# Altium project BLDC_Motor_Driver_PCB.PrjPcb
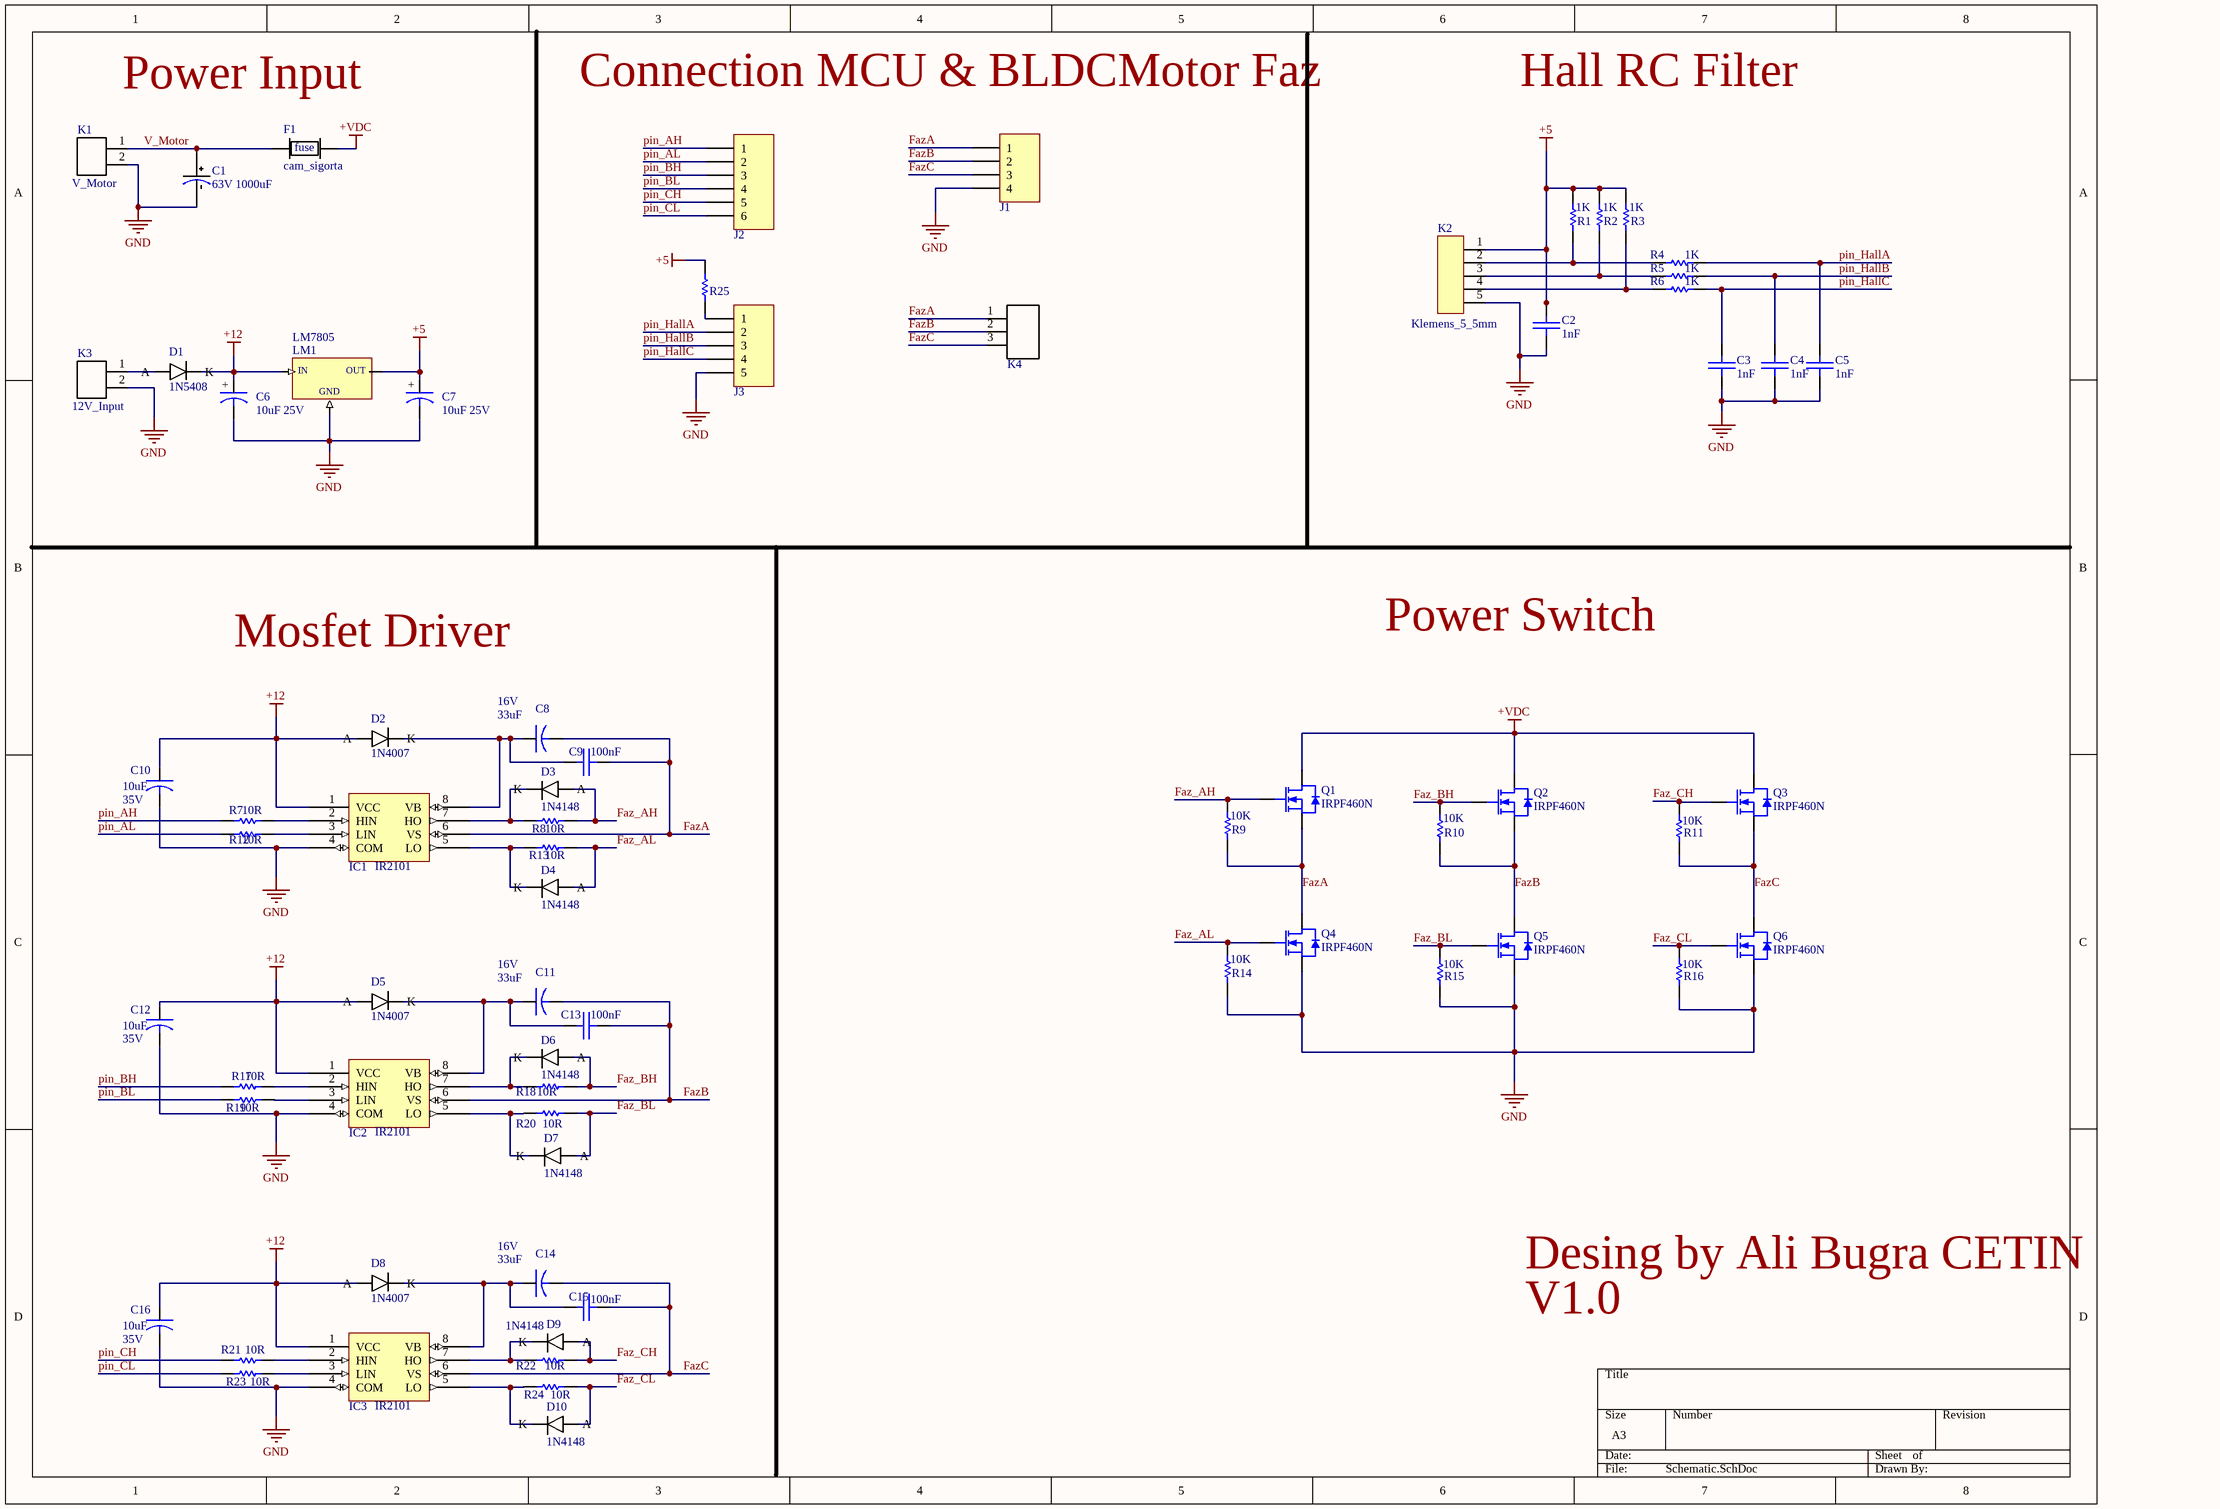
[diagram p0: Schematic.SchDoc]
1 sheet, 69 parts. Net scope: global (net labels, ports and power ports of the same name join across sheets).
Board file: DriverPCB.PcbDoc

## Sheet Schematic.SchDoc
size A3

### Parts
C1  63V 1000uF  [1000uF 10V]
C2  1nF  [100nF]
C3  1nF  [100nF]
C4  1nF  [100nF]
C5  1nF  [100nF]
C6  10uF 25V  [10uF 35V]
C7  10uF 25V  [10uF 35V]
C8  value 33uF  Voltage: 16V  [100uF 25v]  (hidden comment: 100uF 25v)
C9  100nF  [100nF]
C10  value 10uF  Voltage: 35V  [100uF 25v]  (hidden comment: 100uF 25v)
C11  value 33uF  Voltage: 16V  [100uF 25v]  (hidden comment: 100uF 25v)
C12  value 10uF  Voltage: 35V  [100uF 25v]  (hidden comment: 100uF 25v)
C13  100nF  [100nF]
C14  value 33uF  Voltage: 16V  [100uF 25v]  (hidden comment: 100uF 25v)
C15  100nF  [100nF]
C16  value 10uF  Voltage: 35V  [100uF 25v]  (hidden comment: 100uF 25v)
D1  1N5408  [1N5408]
D2  1N4007  [1N4007]
D3  1N4148  [1N4148]
D4  1N4148  [1N4148]
D5  1N4007  [1N4007]
D6  1N4148  [1N4148]
D7  1N4148  [1N4148]
D8  1N4007  [1N4007]
D9  1N4148  [1N4148]
D10  1N4148  [1N4148]
F1  cam_sigorta  [cam_sigorta]
IC1  IR2101  [IR2101-DIP]
IC2  IR2101  [IR2101-DIP]
IC3  IR2101  [IR2101-DIP]
J1  Header 4x1  [Header 4x1]  (value not drawn)
J2  Header 6x1  [Header 6x1]  (value not drawn)
J3  Header 5x1  [Header 5x1]  (value not drawn)
K1  V_Motor  [Klamens_2_3.5mm]
K2  Klemens_5_5mm  [Klamens_5_5mm]
K3  12V_Input  [Klamens_2_3.5mm]
K4  Klemens_3_7.6mm  [Klamens_3_7.6mm]  (value not drawn)
LM1  LM7805  [LM7805]
Q1  IRPF460N  [IRFP460N]
Q2  IRPF460N  [IRFP460N]
Q3  IRPF460N  [IRFP460N]
Q4  IRPF460N  [IRFP460N]
Q5  IRPF460N  [IRFP460N]
Q6  IRPF460N  [IRFP460N]
R1  1K  [RES_DIP]
R2  1K  [RES_DIP]
R3  1K  [RES_DIP]
R4  1K  [RES_DIP]
R5  1K  [RES_DIP]
R6  1K  [RES_DIP]
R7  10R  [RES_DIP]
R8  10R  [RES_DIP]
R9  10K  [RES_DIP]
R10  10K  [RES_DIP]
R11  10K  [RES_DIP]
R12  10R  [RES_DIP]
R13  10R  [RES_DIP]
R14  10K  [RES_DIP]
R15  10K  [RES_DIP]
R16  10K  [RES_DIP]
R17  10R  [RES_DIP]
R18  10R  [RES_DIP]
R19  10R  [RES_DIP]
R20  10R  [RES_DIP]
R21  10R  [RES_DIP]
R22  10R  [RES_DIP]
R23  10R  [RES_DIP]
R24  10R  [RES_DIP]
R25  RES_DIP  [RES_DIP]  (value not drawn)

### Nets
+5: C2.1 C7.+ K2.1 LM1.OUT R1.2 R2.2 R3.2 R25.1
+12: C6.+ C10.1 C12.1 C16.1 D1.2(K) D2.1(A) D5.1(A) D8.1(A) IC1.1(VCC) IC2.1(VCC) IC3.1(VCC) LM1.IN
+VDC: F1.2 Q1.2(D) Q2.2(D) Q3.2(D)
GND: C1.NEG C2.2 C3.2 C4.2 C5.2 C6.- C7.- C10.2 C12.2 C16.2 IC1.4(COM) IC2.4(COM) IC3.4(COM) J1.4 J3.5 K1.2 K2.5 K3.2 LM1.GND Q4.3(S) Q5.3(S) Q6.3(S) R14.1 R15.1 R16.1
Faz_AH: D3.1(A) Q1.1(G) R8.2 R9.2
Faz_AL: D4.1(A) Q4.1(G) R13.2 R14.2
Faz_BH: D6.1(A) Q2.1(G) R10.2 R18.2
Faz_BL: D7.1(A) Q5.1(G) R15.2 R20.2
Faz_CH: D9.1(A) Q3.1(G) R11.2 R22.2
Faz_CL: D10.1(A) Q6.1(G) R16.2 R24.2
FazA: C8.2 C9.2 IC1.6(VS) J1.1 K4.1 Q1.3(S) Q4.2(D) R9.1
FazB: C11.2 C13.2 IC2.6(VS) J1.2 K4.2 Q2.3(S) Q5.2(D) R10.1
FazC: C14.2 C15.2 IC3.6(VS) J1.3 K4.3 Q3.3(S) Q6.2(D) R11.1
pin_AH: J2.1 R7.1
pin_AL: J2.2 R12.1
pin_BH: J2.3 R17.1
pin_BL: J2.4 R19.1
pin_CH: J2.5 R21.1
pin_CL: J2.6 R23.1
pin_HallA: C5.1 J3.2 R4.2
pin_HallB: C4.1 J3.3 R5.2
pin_HallC: C3.1 J3.4 R6.2
V_Motor: C1.POS F1.1 K1.1
NetC8_1: C8.1 C9.1 D2.2(K) IC1.8(VB)
NetC11_1: C11.1 C13.1 D5.2(K) IC2.8(VB)
NetC14_1: C14.1 C15.1 D8.2(K) IC3.8(VB)
NetD1_1: D1.1(A) K3.1
NetD3_2: D3.2(K) IC1.7(HO) R8.1
NetD4_2: D4.2(K) IC1.5(LO) R13.1
NetD6_2: D6.2(K) IC2.7(HO) R18.1
NetD7_2: D7.2(K) IC2.5(LO) R20.1
NetD9_2: D9.2(K) IC3.7(HO) R22.1
NetD10_2: D10.2(K) IC3.5(LO) R24.1
NetIC1_2: IC1.2(HIN) R7.2
NetIC1_3: IC1.3(LIN) R12.2
NetIC2_2: IC2.2(HIN) R17.2
NetIC2_3: IC2.3(LIN) R19.2
NetIC3_2: IC3.2(HIN) R21.2
NetIC3_3: IC3.3(LIN) R23.2
NetJ3_1: J3.1 R25.2
NetK2_2: K2.2 R1.1 R4.1
NetK2_3: K2.3 R2.1 R5.1
NetK2_4: K2.4 R3.1 R6.1

### Notes on the sheet
- Power Input
- Connection MCU & BLDCMotor Faz
- Hall RC Filter
- Mosfet Driver
- Power Switch
- Desing by Ali Bugra CETIN
- V1.0
- (in symbol cam_sigorta) fuse

### Library data of the parts
C1 = 1000uF 10V
C2-C5 = 100nF
C6 C7 = 10uF 35V
C8 C10-C12 C14 C16 = 100uF 25v: Manufacturer: Panasonic; Manufacturer Code: EEEHA1C01WP; Unit Price: 0.47 €; Farnell Code: 1973308
K1 K3 = Klamens_2_3.5mm
R1-R24 = RES_DIP